# Altium schematic sheet keymap144.SchDoc
size A3; Organization: Develer s.r.l.; Address1: via Mugellese 1/A; Address2: 50019 Campi Bisenzio; Address3: Firenze; Address4: ITALY; Revision: A; SheetNumber: 1; SheetTotal: 1
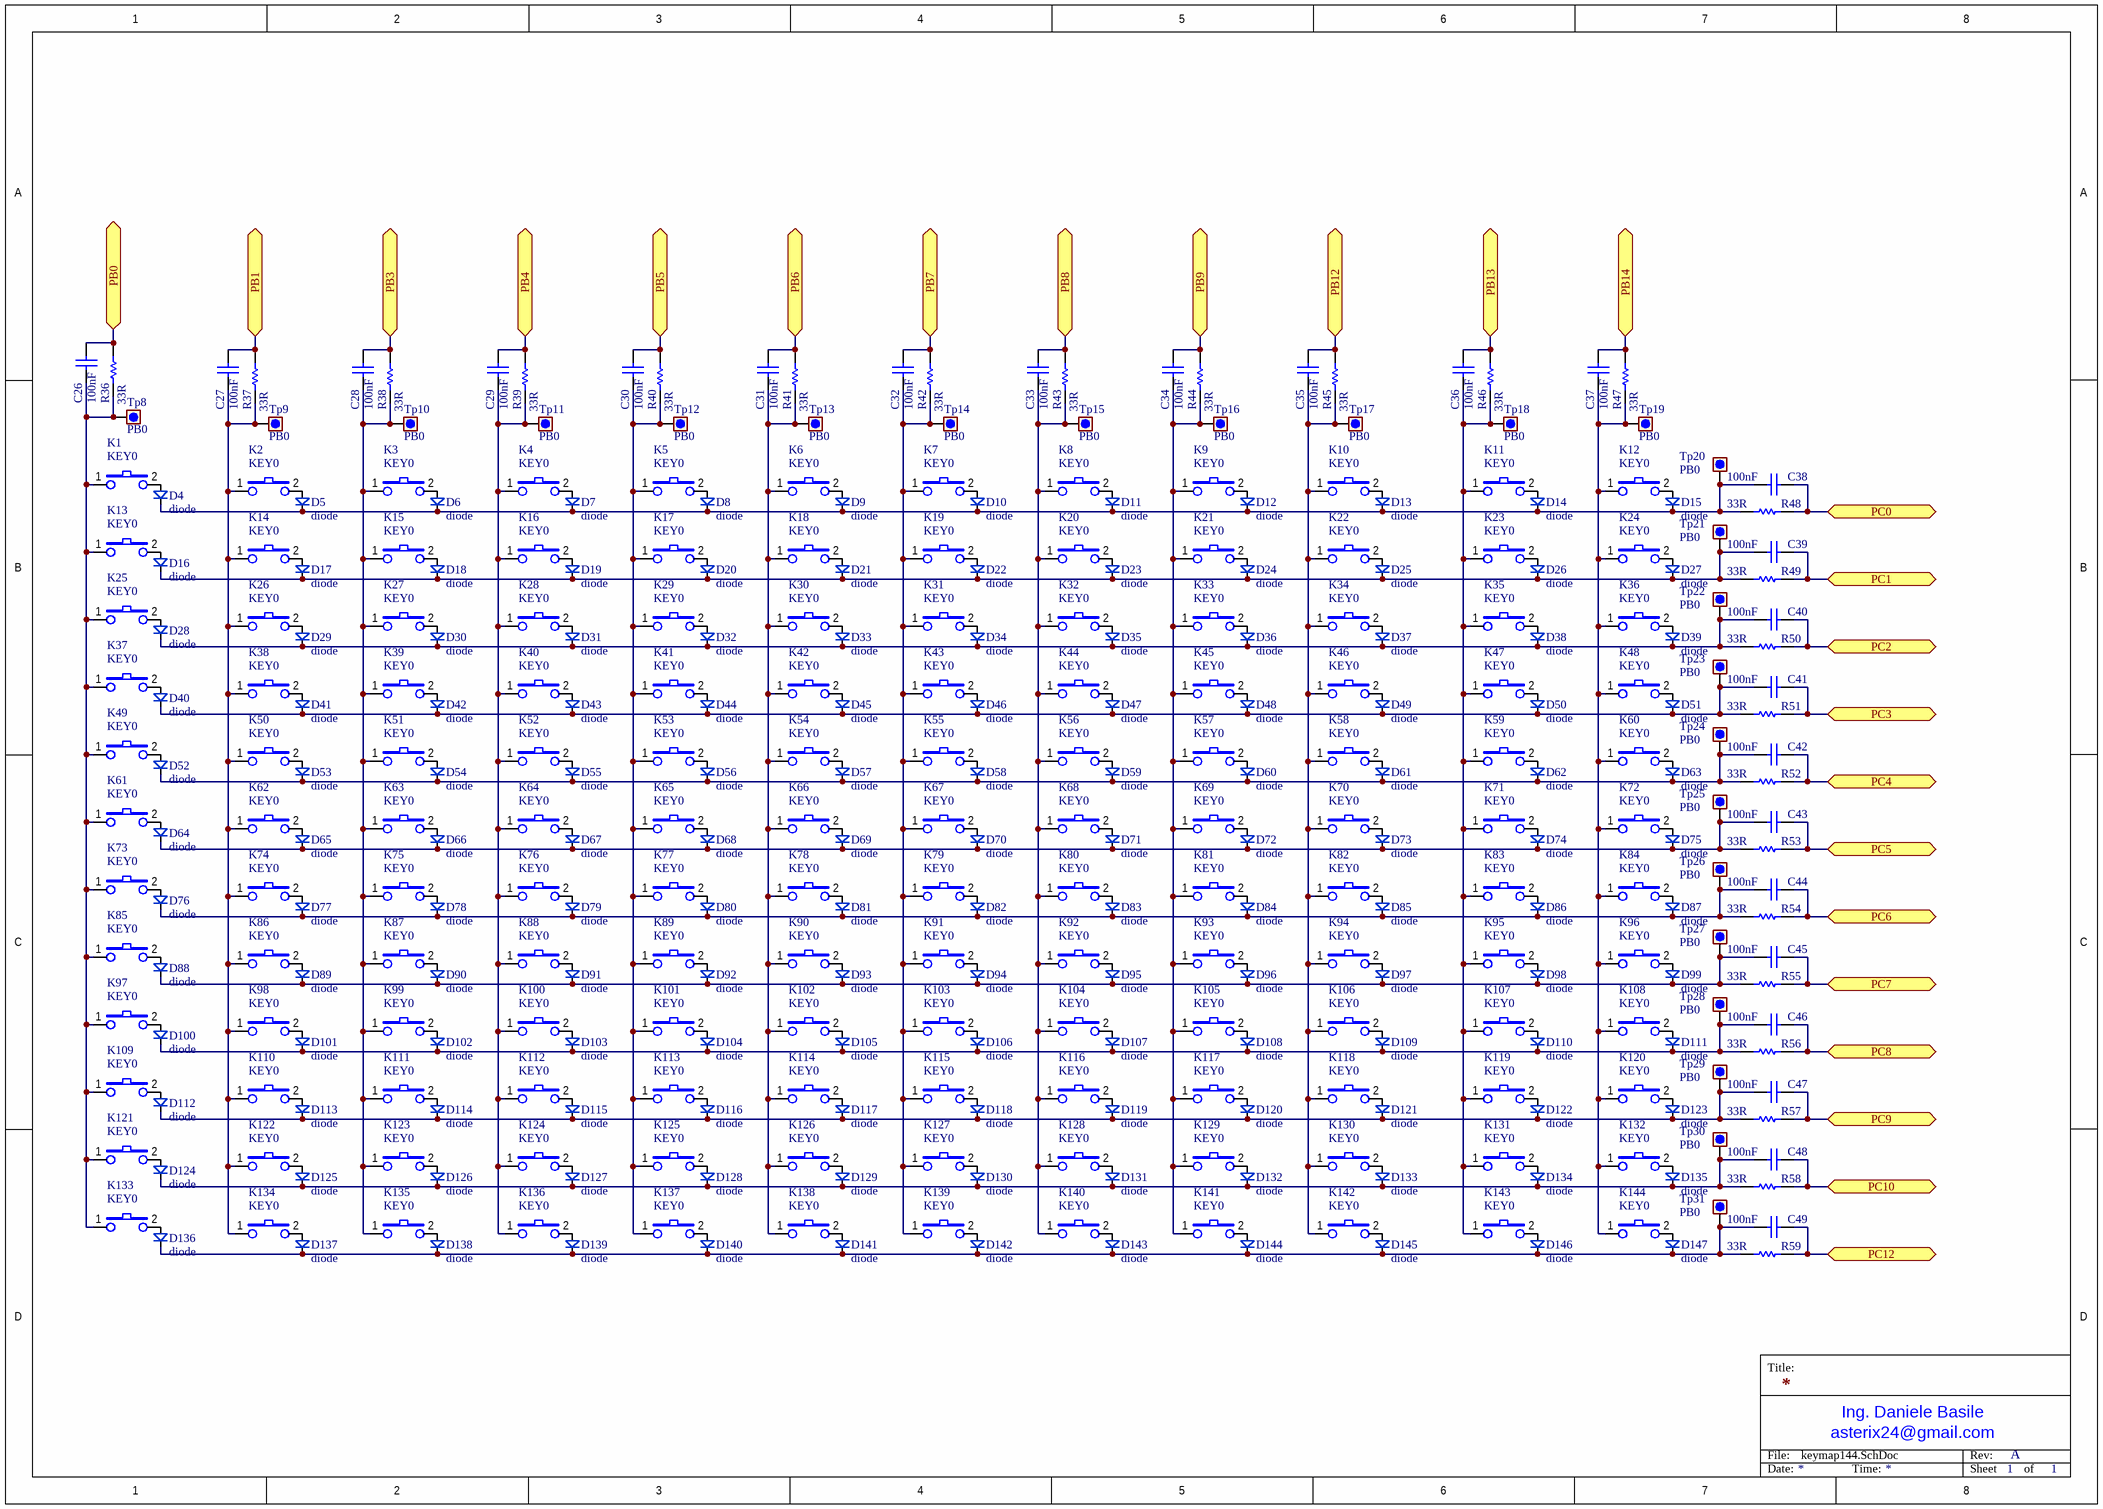
[diagram p0: keymap144.SchDoc]

## Parts
C26  100nF  [0603_[1608]]
C27  100nF  [0603_[1608]]
C28  100nF  [0603_[1608]]
C29  100nF  [0603_[1608]]
C30  100nF  [0603_[1608]]
C31  100nF  [0603_[1608]]
C32  100nF  [0603_[1608]]
C33  100nF  [0603_[1608]]
C34  100nF  [0603_[1608]]
C35  100nF  [0603_[1608]]
C36  100nF  [0603_[1608]]
C37  100nF  [0603_[1608]]
C38  100nF  [0603_[1608]]
C39  100nF  [0603_[1608]]
C40  100nF  [0603_[1608]]
C41  100nF  [0603_[1608]]
C42  100nF  [0603_[1608]]
C43  100nF  [0603_[1608]]
C44  100nF  [0603_[1608]]
C45  100nF  [0603_[1608]]
C46  100nF  [0603_[1608]]
C47  100nF  [0603_[1608]]
C48  100nF  [0603_[1608]]
C49  100nF  [0603_[1608]]
D4  diode  [SOD-123]
D5  diode  [SOD-123]
D6  diode  [SOD-123]
D7  diode  [SOD-123]
D8  diode  [SOD-123]
D9  diode  [SOD-123]
D10  diode  [SOD-123]
D11  diode  [SOD-123]
D12  diode  [SOD-123]
D13  diode  [SOD-123]
D14  diode  [SOD-123]
D15  diode  [SOD-123]
D16  diode  [SOD-123]
D17  diode  [SOD-123]
D18  diode  [SOD-123]
D19  diode  [SOD-123]
D20  diode  [SOD-123]
D21  diode  [SOD-123]
D22  diode  [SOD-123]
D23  diode  [SOD-123]
D24  diode  [SOD-123]
D25  diode  [SOD-123]
D26  diode  [SOD-123]
D27  diode  [SOD-123]
D28  diode  [SOD-123]
D29  diode  [SOD-123]
D30  diode  [SOD-123]
D31  diode  [SOD-123]
D32  diode  [SOD-123]
D33  diode  [SOD-123]
D34  diode  [SOD-123]
D35  diode  [SOD-123]
D36  diode  [SOD-123]
D37  diode  [SOD-123]
D38  diode  [SOD-123]
D39  diode  [SOD-123]
D40  diode  [SOD-123]
D41  diode  [SOD-123]
D42  diode  [SOD-123]
D43  diode  [SOD-123]
D44  diode  [SOD-123]
D45  diode  [SOD-123]
D46  diode  [SOD-123]
D47  diode  [SOD-123]
D48  diode  [SOD-123]
D49  diode  [SOD-123]
D50  diode  [SOD-123]
D51  diode  [SOD-123]
D52  diode  [SOD-123]
D53  diode  [SOD-123]
D54  diode  [SOD-123]
D55  diode  [SOD-123]
D56  diode  [SOD-123]
D57  diode  [SOD-123]
D58  diode  [SOD-123]
D59  diode  [SOD-123]
D60  diode  [SOD-123]
D61  diode  [SOD-123]
D62  diode  [SOD-123]
D63  diode  [SOD-123]
D64  diode  [SOD-123]
D65  diode  [SOD-123]
D66  diode  [SOD-123]
D67  diode  [SOD-123]
D68  diode  [SOD-123]
D69  diode  [SOD-123]
D70  diode  [SOD-123]
D71  diode  [SOD-123]
D72  diode  [SOD-123]
D73  diode  [SOD-123]
D74  diode  [SOD-123]
D75  diode  [SOD-123]
D76  diode  [SOD-123]
D77  diode  [SOD-123]
D78  diode  [SOD-123]
D79  diode  [SOD-123]
D80  diode  [SOD-123]
D81  diode  [SOD-123]
D82  diode  [SOD-123]
D83  diode  [SOD-123]
D84  diode  [SOD-123]
D85  diode  [SOD-123]
D86  diode  [SOD-123]
D87  diode  [SOD-123]
D88  diode  [SOD-123]
D89  diode  [SOD-123]
D90  diode  [SOD-123]
D91  diode  [SOD-123]
D92  diode  [SOD-123]
D93  diode  [SOD-123]
D94  diode  [SOD-123]
D95  diode  [SOD-123]
D96  diode  [SOD-123]
D97  diode  [SOD-123]
D98  diode  [SOD-123]
D99  diode  [SOD-123]
D100  diode  [SOD-123]
D101  diode  [SOD-123]
D102  diode  [SOD-123]
D103  diode  [SOD-123]
D104  diode  [SOD-123]
D105  diode  [SOD-123]
D106  diode  [SOD-123]
D107  diode  [SOD-123]
D108  diode  [SOD-123]
D109  diode  [SOD-123]
D110  diode  [SOD-123]
D111  diode  [SOD-123]
D112  diode  [SOD-123]
D113  diode  [SOD-123]
D114  diode  [SOD-123]
D115  diode  [SOD-123]
D116  diode  [SOD-123]
D117  diode  [SOD-123]
D118  diode  [SOD-123]
D119  diode  [SOD-123]
D120  diode  [SOD-123]
D121  diode  [SOD-123]
D122  diode  [SOD-123]
D123  diode  [SOD-123]
D124  diode  [SOD-123]
D125  diode  [SOD-123]
D126  diode  [SOD-123]
D127  diode  [SOD-123]
D128  diode  [SOD-123]
D129  diode  [SOD-123]
D130  diode  [SOD-123]
D131  diode  [SOD-123]
D132  diode  [SOD-123]
D133  diode  [SOD-123]
D134  diode  [SOD-123]
D135  diode  [SOD-123]
D136  diode  [SOD-123]
D137  diode  [SOD-123]
D138  diode  [SOD-123]
D139  diode  [SOD-123]
D140  diode  [SOD-123]
D141  diode  [SOD-123]
D142  diode  [SOD-123]
D143  diode  [SOD-123]
D144  diode  [SOD-123]
D145  diode  [SOD-123]
D146  diode  [SOD-123]
D147  diode  [SOD-123]
K1  KEY0  [tactile_switch_gateron_pcb]
K2  KEY0  [tactile_switch_gateron_pcb]
K3  KEY0  [tactile_switch_gateron_pcb]
K4  KEY0  [tactile_switch_gateron_pcb]
K5  KEY0  [tactile_switch_gateron_pcb]
K6  KEY0  [tactile_switch_gateron_pcb]
K7  KEY0  [tactile_switch_gateron_pcb]
K8  KEY0  [tactile_switch_gateron_pcb]
K9  KEY0  [tactile_switch_gateron_pcb]
K10  KEY0  [tactile_switch_gateron_pcb]
K11  KEY0  [tactile_switch_gateron_pcb]
K12  KEY0  [tactile_switch_gateron_pcb]
K13  KEY0  [tactile_switch_gateron_pcb]
K14  KEY0  [tactile_switch_gateron_pcb]
K15  KEY0  [tactile_switch_gateron_pcb]
K16  KEY0  [tactile_switch_gateron_pcb]
K17  KEY0  [tactile_switch_gateron_pcb]
K18  KEY0  [tactile_switch_gateron_pcb]
K19  KEY0  [tactile_switch_gateron_pcb]
K20  KEY0  [tactile_switch_gateron_pcb]
K21  KEY0  [tactile_switch_gateron_pcb]
K22  KEY0  [tactile_switch_gateron_pcb]
K23  KEY0  [tactile_switch_gateron_pcb]
K24  KEY0  [tactile_switch_gateron_pcb]
K25  KEY0  [tactile_switch_gateron_pcb]
K26  KEY0  [tactile_switch_gateron_pcb]
K27  KEY0  [tactile_switch_gateron_pcb]
K28  KEY0  [tactile_switch_gateron_pcb]
K29  KEY0  [tactile_switch_gateron_pcb]
K30  KEY0  [tactile_switch_gateron_pcb]
K31  KEY0  [tactile_switch_gateron_pcb]
K32  KEY0  [tactile_switch_gateron_pcb]
K33  KEY0  [tactile_switch_gateron_pcb]
K34  KEY0  [tactile_switch_gateron_pcb]
K35  KEY0  [tactile_switch_gateron_pcb]
K36  KEY0  [tactile_switch_gateron_pcb]
K37  KEY0  [tactile_switch_gateron_pcb]
K38  KEY0  [tactile_switch_gateron_pcb]
K39  KEY0  [tactile_switch_gateron_pcb]
K40  KEY0  [tactile_switch_gateron_pcb]
K41  KEY0  [tactile_switch_gateron_pcb]
K42  KEY0  [tactile_switch_gateron_pcb]
K43  KEY0  [tactile_switch_gateron_pcb]
K44  KEY0  [tactile_switch_gateron_pcb]
K45  KEY0  [tactile_switch_gateron_pcb]
K46  KEY0  [tactile_switch_gateron_pcb]
K47  KEY0  [tactile_switch_gateron_pcb]
K48  KEY0  [tactile_switch_gateron_pcb]
K49  KEY0  [tactile_switch_gateron_pcb]
K50  KEY0  [tactile_switch_gateron_pcb]
K51  KEY0  [tactile_switch_gateron_pcb]
K52  KEY0  [tactile_switch_gateron_pcb]
K53  KEY0  [tactile_switch_gateron_pcb]
K54  KEY0  [tactile_switch_gateron_pcb]
K55  KEY0  [tactile_switch_gateron_pcb]
K56  KEY0  [tactile_switch_gateron_pcb]
K57  KEY0  [tactile_switch_gateron_pcb]
K58  KEY0  [tactile_switch_gateron_pcb]
K59  KEY0  [tactile_switch_gateron_pcb]
K60  KEY0  [tactile_switch_gateron_pcb]
K61  KEY0  [tactile_switch_gateron_pcb]
K62  KEY0  [tactile_switch_gateron_pcb]
K63  KEY0  [tactile_switch_gateron_pcb]
K64  KEY0  [tactile_switch_gateron_pcb]
K65  KEY0  [tactile_switch_gateron_pcb]
K66  KEY0  [tactile_switch_gateron_pcb]
K67  KEY0  [tactile_switch_gateron_pcb]
K68  KEY0  [tactile_switch_gateron_pcb]
K69  KEY0  [tactile_switch_gateron_pcb]
K70  KEY0  [tactile_switch_gateron_pcb]
K71  KEY0  [tactile_switch_gateron_pcb]
K72  KEY0  [tactile_switch_gateron_pcb]
K73  KEY0  [tactile_switch_gateron_pcb]
K74  KEY0  [tactile_switch_gateron_pcb]
K75  KEY0  [tactile_switch_gateron_pcb]
K76  KEY0  [tactile_switch_gateron_pcb]
K77  KEY0  [tactile_switch_gateron_pcb]
K78  KEY0  [tactile_switch_gateron_pcb]
K79  KEY0  [tactile_switch_gateron_pcb]
K80  KEY0  [tactile_switch_gateron_pcb]
K81  KEY0  [tactile_switch_gateron_pcb]
K82  KEY0  [tactile_switch_gateron_pcb]
K83  KEY0  [tactile_switch_gateron_pcb]
K84  KEY0  [tactile_switch_gateron_pcb]
K85  KEY0  [tactile_switch_gateron_pcb]
K86  KEY0  [tactile_switch_gateron_pcb]
K87  KEY0  [tactile_switch_gateron_pcb]
K88  KEY0  [tactile_switch_gateron_pcb]
K89  KEY0  [tactile_switch_gateron_pcb]
K90  KEY0  [tactile_switch_gateron_pcb]
K91  KEY0  [tactile_switch_gateron_pcb]
K92  KEY0  [tactile_switch_gateron_pcb]
K93  KEY0  [tactile_switch_gateron_pcb]
K94  KEY0  [tactile_switch_gateron_pcb]
K95  KEY0  [tactile_switch_gateron_pcb]
K96  KEY0  [tactile_switch_gateron_pcb]
K97  KEY0  [tactile_switch_gateron_pcb]
K98  KEY0  [tactile_switch_gateron_pcb]
K99  KEY0  [tactile_switch_gateron_pcb]
K100  KEY0  [tactile_switch_gateron_pcb]
K101  KEY0  [tactile_switch_gateron_pcb]
K102  KEY0  [tactile_switch_gateron_pcb]
K103  KEY0  [tactile_switch_gateron_pcb]
K104  KEY0  [tactile_switch_gateron_pcb]
K105  KEY0  [tactile_switch_gateron_pcb]
K106  KEY0  [tactile_switch_gateron_pcb]
K107  KEY0  [tactile_switch_gateron_pcb]
K108  KEY0  [tactile_switch_gateron_pcb]
K109  KEY0  [tactile_switch_gateron_pcb]
K110  KEY0  [tactile_switch_gateron_pcb]
K111  KEY0  [tactile_switch_gateron_pcb]
K112  KEY0  [tactile_switch_gateron_pcb]
K113  KEY0  [tactile_switch_gateron_pcb]
K114  KEY0  [tactile_switch_gateron_pcb]
K115  KEY0  [tactile_switch_gateron_pcb]
K116  KEY0  [tactile_switch_gateron_pcb]
K117  KEY0  [tactile_switch_gateron_pcb]
K118  KEY0  [tactile_switch_gateron_pcb]
K119  KEY0  [tactile_switch_gateron_pcb]
K120  KEY0  [tactile_switch_gateron_pcb]
K121  KEY0  [tactile_switch_gateron_pcb]
K122  KEY0  [tactile_switch_gateron_pcb]
K123  KEY0  [tactile_switch_gateron_pcb]
K124  KEY0  [tactile_switch_gateron_pcb]
K125  KEY0  [tactile_switch_gateron_pcb]
K126  KEY0  [tactile_switch_gateron_pcb]
K127  KEY0  [tactile_switch_gateron_pcb]
K128  KEY0  [tactile_switch_gateron_pcb]
K129  KEY0  [tactile_switch_gateron_pcb]
K130  KEY0  [tactile_switch_gateron_pcb]
K131  KEY0  [tactile_switch_gateron_pcb]
K132  KEY0  [tactile_switch_gateron_pcb]
K133  KEY0  [tactile_switch_gateron_pcb]
K134  KEY0  [tactile_switch_gateron_pcb]
K135  KEY0  [tactile_switch_gateron_pcb]
K136  KEY0  [tactile_switch_gateron_pcb]
K137  KEY0  [tactile_switch_gateron_pcb]
K138  KEY0  [tactile_switch_gateron_pcb]
K139  KEY0  [tactile_switch_gateron_pcb]
K140  KEY0  [tactile_switch_gateron_pcb]
K141  KEY0  [tactile_switch_gateron_pcb]
K142  KEY0  [tactile_switch_gateron_pcb]
K143  KEY0  [tactile_switch_gateron_pcb]
K144  KEY0  [tactile_switch_gateron_pcb]
R36  33R  [0603_[1608]]
R37  33R  [0603_[1608]]
R38  33R  [0603_[1608]]
R39  33R  [0603_[1608]]
R40  33R  [0603_[1608]]
R41  33R  [0603_[1608]]
R42  33R  [0603_[1608]]
R43  33R  [0603_[1608]]
R44  33R  [0603_[1608]]
R45  33R  [0603_[1608]]
R46  33R  [0603_[1608]]
R47  33R  [0603_[1608]]
R48  33R  [0603_[1608]]
R49  33R  [0603_[1608]]
R50  33R  [0603_[1608]]
R51  33R  [0603_[1608]]
R52  33R  [0603_[1608]]
R53  33R  [0603_[1608]]
R54  33R  [0603_[1608]]
R55  33R  [0603_[1608]]
R56  33R  [0603_[1608]]
R57  33R  [0603_[1608]]
R58  33R  [0603_[1608]]
R59  33R  [0603_[1608]]
Tp8  PB0  [TEST_POINT_THD_D1.8MM]  (no BOM)
Tp9  PB0  [TEST_POINT_THD_D1.8MM]  (no BOM)
Tp10  PB0  [TEST_POINT_THD_D1.8MM]  (no BOM)
Tp11  PB0  [TEST_POINT_THD_D1.8MM]  (no BOM)
Tp12  PB0  [TEST_POINT_THD_D1.8MM]  (no BOM)
Tp13  PB0  [TEST_POINT_THD_D1.8MM]  (no BOM)
Tp14  PB0  [TEST_POINT_THD_D1.8MM]  (no BOM)
Tp15  PB0  [TEST_POINT_THD_D1.8MM]  (no BOM)
Tp16  PB0  [TEST_POINT_THD_D1.8MM]  (no BOM)
Tp17  PB0  [TEST_POINT_THD_D1.8MM]  (no BOM)
Tp18  PB0  [TEST_POINT_THD_D1.8MM]  (no BOM)
Tp19  PB0  [TEST_POINT_THD_D1.8MM]  (no BOM)
Tp20  PB0  [TEST_POINT_THD_D1.8MM]  (no BOM)
Tp21  PB0  [TEST_POINT_THD_D1.8MM]  (no BOM)
Tp22  PB0  [TEST_POINT_THD_D1.8MM]  (no BOM)
Tp23  PB0  [TEST_POINT_THD_D1.8MM]  (no BOM)
Tp24  PB0  [TEST_POINT_THD_D1.8MM]  (no BOM)
Tp25  PB0  [TEST_POINT_THD_D1.8MM]  (no BOM)
Tp26  PB0  [TEST_POINT_THD_D1.8MM]  (no BOM)
Tp27  PB0  [TEST_POINT_THD_D1.8MM]  (no BOM)
Tp28  PB0  [TEST_POINT_THD_D1.8MM]  (no BOM)
Tp29  PB0  [TEST_POINT_THD_D1.8MM]  (no BOM)
Tp30  PB0  [TEST_POINT_THD_D1.8MM]  (no BOM)
Tp31  PB0  [TEST_POINT_THD_D1.8MM]  (no BOM)

## Ports
PB0, PB1, PB3, PB4, PB5, PB6, PB7, PB8, PB9, PB12, PB13, PB14, PC0, PC1, PC2, PC3, PC4, PC5, PC6, PC7, PC8, PC9, PC10, PC12

## Nets
PB0: C26.2 R36.2 ; port PB0
PB1: C27.2 R37.2 ; port PB1
PB3: C28.2 R38.2 ; port PB3
PB4: C29.2 R39.2 ; port PB4
PB5: C30.2 R40.2 ; port PB5
PB6: C31.2 R41.2 ; port PB6
PB7: C32.2 R42.2 ; port PB7
PB8: C33.2 R43.2 ; port PB8
PB9: C34.2 R44.2 ; port PB9
PB12: C35.2 R45.2 ; port PB12
PB13: C36.2 R46.2 ; port PB13
PB14: C37.2 R47.2 ; port PB14
PC0: C38.2 R48.2 ; port PC0
PC1: C39.2 R49.2 ; port PC1
PC2: C40.2 R50.2 ; port PC2
PC3: C41.2 R51.2 ; port PC3
PC4: C42.2 R52.2 ; port PC4
PC5: C43.2 R53.2 ; port PC5
PC6: C44.2 R54.2 ; port PC6
PC7: C45.2 R55.2 ; port PC7
PC8: C46.2 R56.2 ; port PC8
PC9: C47.2 R57.2 ; port PC9
PC10: C48.2 R58.2 ; port PC10
PC12: C49.2 R59.2 ; port PC12
NetC26_1: C26.1 K1.1 K13.1 K25.1 K37.1 K49.1 K61.1 K73.1 K85.1 K97.1 K109.1 K121.1 K133.1 R36.1 Tp8.1
NetC27_1: C27.1 K2.1 K14.1 K26.1 K38.1 K50.1 K62.1 K74.1 K86.1 K98.1 K110.1 K122.1 K134.1 R37.1 Tp9.1
NetC28_1: C28.1 K3.1 K15.1 K27.1 K39.1 K51.1 K63.1 K75.1 K87.1 K99.1 K111.1 K123.1 K135.1 R38.1 Tp10.1
NetC29_1: C29.1 K4.1 K16.1 K28.1 K40.1 K52.1 K64.1 K76.1 K88.1 K100.1 K112.1 K124.1 K136.1 R39.1 Tp11.1
NetC30_1: C30.1 K5.1 K17.1 K29.1 K41.1 K53.1 K65.1 K77.1 K89.1 K101.1 K113.1 K125.1 K137.1 R40.1 Tp12.1
NetC31_1: C31.1 K6.1 K18.1 K30.1 K42.1 K54.1 K66.1 K78.1 K90.1 K102.1 K114.1 K126.1 K138.1 R41.1 Tp13.1
NetC32_1: C32.1 K7.1 K19.1 K31.1 K43.1 K55.1 K67.1 K79.1 K91.1 K103.1 K115.1 K127.1 K139.1 R42.1 Tp14.1
NetC33_1: C33.1 K8.1 K20.1 K32.1 K44.1 K56.1 K68.1 K80.1 K92.1 K104.1 K116.1 K128.1 K140.1 R43.1 Tp15.1
NetC34_1: C34.1 K9.1 K21.1 K33.1 K45.1 K57.1 K69.1 K81.1 K93.1 K105.1 K117.1 K129.1 K141.1 R44.1 Tp16.1
NetC35_1: C35.1 K10.1 K22.1 K34.1 K46.1 K58.1 K70.1 K82.1 K94.1 K106.1 K118.1 K130.1 K142.1 R45.1 Tp17.1
NetC36_1: C36.1 K11.1 K23.1 K35.1 K47.1 K59.1 K71.1 K83.1 K95.1 K107.1 K119.1 K131.1 K143.1 R46.1 Tp18.1
NetC37_1: C37.1 K12.1 K24.1 K36.1 K48.1 K60.1 K72.1 K84.1 K96.1 K108.1 K120.1 K132.1 K144.1 R47.1 Tp19.1
NetC38_1: C38.1 D4.1(K) D5.1(K) D6.1(K) D7.1(K) D8.1(K) D9.1(K) D10.1(K) D11.1(K) D12.1(K) D13.1(K) D14.1(K) D15.1(K) R48.1 Tp20.1
NetC39_1: C39.1 D16.1(K) D17.1(K) D18.1(K) D19.1(K) D20.1(K) D21.1(K) D22.1(K) D23.1(K) D24.1(K) D25.1(K) D26.1(K) D27.1(K) R49.1 Tp21.1
NetC40_1: C40.1 D28.1(K) D29.1(K) D30.1(K) D31.1(K) D32.1(K) D33.1(K) D34.1(K) D35.1(K) D36.1(K) D37.1(K) D38.1(K) D39.1(K) R50.1 Tp22.1
NetC41_1: C41.1 D40.1(K) D41.1(K) D42.1(K) D43.1(K) D44.1(K) D45.1(K) D46.1(K) D47.1(K) D48.1(K) D49.1(K) D50.1(K) D51.1(K) R51.1 Tp23.1
NetC42_1: C42.1 D52.1(K) D53.1(K) D54.1(K) D55.1(K) D56.1(K) D57.1(K) D58.1(K) D59.1(K) D60.1(K) D61.1(K) D62.1(K) D63.1(K) R52.1 Tp24.1
NetC43_1: C43.1 D64.1(K) D65.1(K) D66.1(K) D67.1(K) D68.1(K) D69.1(K) D70.1(K) D71.1(K) D72.1(K) D73.1(K) D74.1(K) D75.1(K) R53.1 Tp25.1
NetC44_1: C44.1 D76.1(K) D77.1(K) D78.1(K) D79.1(K) D80.1(K) D81.1(K) D82.1(K) D83.1(K) D84.1(K) D85.1(K) D86.1(K) D87.1(K) R54.1 Tp26.1
NetC45_1: C45.1 D88.1(K) D89.1(K) D90.1(K) D91.1(K) D92.1(K) D93.1(K) D94.1(K) D95.1(K) D96.1(K) D97.1(K) D98.1(K) D99.1(K) R55.1 Tp27.1
NetC46_1: C46.1 D100.1(K) D101.1(K) D102.1(K) D103.1(K) D104.1(K) D105.1(K) D106.1(K) D107.1(K) D108.1(K) D109.1(K) D110.1(K) D111.1(K) R56.1 Tp28.1
NetC47_1: C47.1 D112.1(K) D113.1(K) D114.1(K) D115.1(K) D116.1(K) D117.1(K) D118.1(K) D119.1(K) D120.1(K) D121.1(K) D122.1(K) D123.1(K) R57.1 Tp29.1
NetC48_1: C48.1 D124.1(K) D125.1(K) D126.1(K) D127.1(K) D128.1(K) D129.1(K) D130.1(K) D131.1(K) D132.1(K) D133.1(K) D134.1(K) D135.1(K) R58.1 Tp30.1
NetC49_1: C49.1 D136.1(K) D137.1(K) D138.1(K) D139.1(K) D140.1(K) D141.1(K) D142.1(K) D143.1(K) D144.1(K) D145.1(K) D146.1(K) D147.1(K) R59.1 Tp31.1
NetD4_2: D4.2(A) K1.2
NetD5_2: D5.2(A) K2.2
NetD6_2: D6.2(A) K3.2
NetD7_2: D7.2(A) K4.2
NetD8_2: D8.2(A) K5.2
NetD9_2: D9.2(A) K6.2
NetD10_2: D10.2(A) K7.2
NetD11_2: D11.2(A) K8.2
NetD12_2: D12.2(A) K9.2
NetD13_2: D13.2(A) K10.2
NetD14_2: D14.2(A) K11.2
NetD15_2: D15.2(A) K12.2
NetD16_2: D16.2(A) K13.2
NetD17_2: D17.2(A) K14.2
NetD18_2: D18.2(A) K15.2
NetD19_2: D19.2(A) K16.2
NetD20_2: D20.2(A) K17.2
NetD21_2: D21.2(A) K18.2
NetD22_2: D22.2(A) K19.2
NetD23_2: D23.2(A) K20.2
NetD24_2: D24.2(A) K21.2
NetD25_2: D25.2(A) K22.2
NetD26_2: D26.2(A) K23.2
NetD27_2: D27.2(A) K24.2
NetD28_2: D28.2(A) K25.2
NetD29_2: D29.2(A) K26.2
NetD30_2: D30.2(A) K27.2
NetD31_2: D31.2(A) K28.2
NetD32_2: D32.2(A) K29.2
NetD33_2: D33.2(A) K30.2
NetD34_2: D34.2(A) K31.2
NetD35_2: D35.2(A) K32.2
NetD36_2: D36.2(A) K33.2
NetD37_2: D37.2(A) K34.2
NetD38_2: D38.2(A) K35.2
NetD39_2: D39.2(A) K36.2
NetD40_2: D40.2(A) K37.2
NetD41_2: D41.2(A) K38.2
NetD42_2: D42.2(A) K39.2
NetD43_2: D43.2(A) K40.2
NetD44_2: D44.2(A) K41.2
NetD45_2: D45.2(A) K42.2
NetD46_2: D46.2(A) K43.2
NetD47_2: D47.2(A) K44.2
NetD48_2: D48.2(A) K45.2
NetD49_2: D49.2(A) K46.2
NetD50_2: D50.2(A) K47.2
NetD51_2: D51.2(A) K48.2
NetD52_2: D52.2(A) K49.2
NetD53_2: D53.2(A) K50.2
NetD54_2: D54.2(A) K51.2
NetD55_2: D55.2(A) K52.2
NetD56_2: D56.2(A) K53.2
NetD57_2: D57.2(A) K54.2
NetD58_2: D58.2(A) K55.2
NetD59_2: D59.2(A) K56.2
NetD60_2: D60.2(A) K57.2
NetD61_2: D61.2(A) K58.2
NetD62_2: D62.2(A) K59.2
NetD63_2: D63.2(A) K60.2
NetD64_2: D64.2(A) K61.2
NetD65_2: D65.2(A) K62.2
NetD66_2: D66.2(A) K63.2
NetD67_2: D67.2(A) K64.2
NetD68_2: D68.2(A) K65.2
NetD69_2: D69.2(A) K66.2
NetD70_2: D70.2(A) K67.2
NetD71_2: D71.2(A) K68.2
NetD72_2: D72.2(A) K69.2
NetD73_2: D73.2(A) K70.2
NetD74_2: D74.2(A) K71.2
NetD75_2: D75.2(A) K72.2
NetD76_2: D76.2(A) K73.2
NetD77_2: D77.2(A) K74.2
NetD78_2: D78.2(A) K75.2
NetD79_2: D79.2(A) K76.2
NetD80_2: D80.2(A) K77.2
NetD81_2: D81.2(A) K78.2
NetD82_2: D82.2(A) K79.2
NetD83_2: D83.2(A) K80.2
NetD84_2: D84.2(A) K81.2
NetD85_2: D85.2(A) K82.2
NetD86_2: D86.2(A) K83.2
NetD87_2: D87.2(A) K84.2
NetD88_2: D88.2(A) K85.2
NetD89_2: D89.2(A) K86.2
NetD90_2: D90.2(A) K87.2
NetD91_2: D91.2(A) K88.2
NetD92_2: D92.2(A) K89.2
NetD93_2: D93.2(A) K90.2
NetD94_2: D94.2(A) K91.2
NetD95_2: D95.2(A) K92.2
NetD96_2: D96.2(A) K93.2
NetD97_2: D97.2(A) K94.2
NetD98_2: D98.2(A) K95.2
NetD99_2: D99.2(A) K96.2
NetD100_2: D100.2(A) K97.2
NetD101_2: D101.2(A) K98.2
NetD102_2: D102.2(A) K99.2
NetD103_2: D103.2(A) K100.2
NetD104_2: D104.2(A) K101.2
NetD105_2: D105.2(A) K102.2
NetD106_2: D106.2(A) K103.2
NetD107_2: D107.2(A) K104.2
NetD108_2: D108.2(A) K105.2
NetD109_2: D109.2(A) K106.2
NetD110_2: D110.2(A) K107.2
NetD111_2: D111.2(A) K108.2
NetD112_2: D112.2(A) K109.2
NetD113_2: D113.2(A) K110.2
NetD114_2: D114.2(A) K111.2
NetD115_2: D115.2(A) K112.2
NetD116_2: D116.2(A) K113.2
NetD117_2: D117.2(A) K114.2
NetD118_2: D118.2(A) K115.2
NetD119_2: D119.2(A) K116.2
NetD120_2: D120.2(A) K117.2
NetD121_2: D121.2(A) K118.2
NetD122_2: D122.2(A) K119.2
NetD123_2: D123.2(A) K120.2
NetD124_2: D124.2(A) K121.2
NetD125_2: D125.2(A) K122.2
NetD126_2: D126.2(A) K123.2
NetD127_2: D127.2(A) K124.2
NetD128_2: D128.2(A) K125.2
NetD129_2: D129.2(A) K126.2
NetD130_2: D130.2(A) K127.2
NetD131_2: D131.2(A) K128.2
NetD132_2: D132.2(A) K129.2
NetD133_2: D133.2(A) K130.2
NetD134_2: D134.2(A) K131.2
NetD135_2: D135.2(A) K132.2
NetD136_2: D136.2(A) K133.2
NetD137_2: D137.2(A) K134.2
NetD138_2: D138.2(A) K135.2
NetD139_2: D139.2(A) K136.2
NetD140_2: D140.2(A) K137.2
NetD141_2: D141.2(A) K138.2
NetD142_2: D142.2(A) K139.2
NetD143_2: D143.2(A) K140.2
NetD144_2: D144.2(A) K141.2
NetD145_2: D145.2(A) K142.2
NetD146_2: D146.2(A) K143.2
NetD147_2: D147.2(A) K144.2

Not connected (* = marked no-connect by the designer): K1 3(GND) 4(GND); K2 3(GND) 4(GND); K3 3(GND) 4(GND); K4 3(GND) 4(GND); K5 3(GND) 4(GND); K6 3(GND) 4(GND); K7 3(GND) 4(GND); K8 3(GND) 4(GND); K9 3(GND) 4(GND); K10 3(GND) 4(GND); K11 3(GND) 4(GND); K12 3(GND) 4(GND); K13 3(GND) 4(GND); K14 3(GND) 4(GND); K15 3(GND) 4(GND); K16 3(GND) 4(GND); K17 3(GND) 4(GND); K18 3(GND) 4(GND); K19 3(GND) 4(GND); K20 3(GND) 4(GND); K21 3(GND) 4(GND); K22 3(GND) 4(GND); K23 3(GND) 4(GND); K24 3(GND) 4(GND); K25 3(GND) 4(GND); K26 3(GND) 4(GND); K27 3(GND) 4(GND); K28 3(GND) 4(GND); K29 3(GND) 4(GND); K30 3(GND) 4(GND); K31 3(GND) 4(GND); K32 3(GND) 4(GND); K33 3(GND) 4(GND); K34 3(GND) 4(GND); K35 3(GND) 4(GND); K36 3(GND) 4(GND); K37 3(GND) 4(GND); K38 3(GND) 4(GND); K39 3(GND) 4(GND); K40 3(GND) 4(GND); K41 3(GND) 4(GND); K42 3(GND) 4(GND); K43 3(GND) 4(GND); K44 3(GND) 4(GND); K45 3(GND) 4(GND); K46 3(GND) 4(GND); K47 3(GND) 4(GND); K48 3(GND) 4(GND); K49 3(GND) 4(GND); K50 3(GND) 4(GND); K51 3(GND) 4(GND); K52 3(GND) 4(GND); K53 3(GND) 4(GND); K54 3(GND) 4(GND); K55 3(GND) 4(GND); K56 3(GND) 4(GND); K57 3(GND) 4(GND); K58 3(GND) 4(GND); K59 3(GND) 4(GND); K60 3(GND) 4(GND); K61 3(GND) 4(GND); K62 3(GND) 4(GND); K63 3(GND) 4(GND); K64 3(GND) 4(GND); K65 3(GND) 4(GND); K66 3(GND) 4(GND); K67 3(GND) 4(GND); K68 3(GND) 4(GND); K69 3(GND) 4(GND); K70 3(GND) 4(GND); K71 3(GND) 4(GND); K72 3(GND) 4(GND); K73 3(GND) 4(GND); K74 3(GND) 4(GND); K75 3(GND) 4(GND); K76 3(GND) 4(GND); K77 3(GND) 4(GND); K78 3(GND) 4(GND); K79 3(GND) 4(GND); K80 3(GND) 4(GND); K81 3(GND) 4(GND); K82 3(GND) 4(GND); K83 3(GND) 4(GND); K84 3(GND) 4(GND); K85 3(GND) 4(GND); K86 3(GND) 4(GND); K87 3(GND) 4(GND); K88 3(GND) 4(GND); K89 3(GND) 4(GND); K90 3(GND) 4(GND); K91 3(GND) 4(GND); K92 3(GND) 4(GND); K93 3(GND) 4(GND); K94 3(GND) 4(GND); K95 3(GND) 4(GND); K96 3(GND) 4(GND); K97 3(GND) 4(GND); K98 3(GND) 4(GND); K99 3(GND) 4(GND); K100 3(GND) 4(GND); K101 3(GND) 4(GND); K102 3(GND) 4(GND); K103 3(GND) 4(GND); K104 3(GND) 4(GND); K105 3(GND) 4(GND); K106 3(GND) 4(GND); K107 3(GND) 4(GND); K108 3(GND) 4(GND); K109 3(GND) 4(GND); K110 3(GND) 4(GND); K111 3(GND) 4(GND); K112 3(GND) 4(GND); K113 3(GND) 4(GND); K114 3(GND) 4(GND); K115 3(GND) 4(GND); K116 3(GND) 4(GND); K117 3(GND) 4(GND); K118 3(GND) 4(GND); K119 3(GND) 4(GND); K120 3(GND) 4(GND); K121 3(GND) 4(GND); K122 3(GND) 4(GND); K123 3(GND) 4(GND); K124 3(GND) 4(GND); K125 3(GND) 4(GND); K126 3(GND) 4(GND); K127 3(GND) 4(GND); K128 3(GND) 4(GND); K129 3(GND) 4(GND); K130 3(GND) 4(GND); K131 3(GND) 4(GND); K132 3(GND) 4(GND); K133 3(GND) 4(GND); K134 3(GND) 4(GND); K135 3(GND) 4(GND); K136 3(GND) 4(GND); K137 3(GND) 4(GND); K138 3(GND) 4(GND); K139 3(GND) 4(GND); K140 3(GND) 4(GND); K141 3(GND) 4(GND); K142 3(GND) 4(GND); K143 3(GND) 4(GND); K144 3(GND) 4(GND)

## Notes on the sheet
- Title:
- File:
- asterix24@gmail.com
- Ing. Daniele Basile
- Rev:
- Date:
- Time:
- Sheet
- of

## Library data of the parts
C26-C49 = Cap: Ceramic X7R 50V; Value: 10nF; Published: 8-Jun-2000; Revision: July-2002: Re-released for DXP Platform.; Publisher: Altium Limited
D4-D147 = diode_small: Diode Schottky  low Vf, If 1A (PMEG3010ER; MBRX120LF)
K1-K144 = SWITCH-RA: Tactile Switch Right Angle 6x6; Part Number: Tyco FSMRA2JH; Purchase Code: RS 479-1520
R36-R59 = Res1: Resistor; Value: 1K; Published: 8-Jun-2000; Revision: July-2002: Re-released for DXP Platform.; Publisher: Altium Limited
Tp8-Tp31 = Test_point: Test point